# Altium schematic sheet 3_bp_filter.SchDoc
size A; SheetNumber: 4; SheetTotal: 7
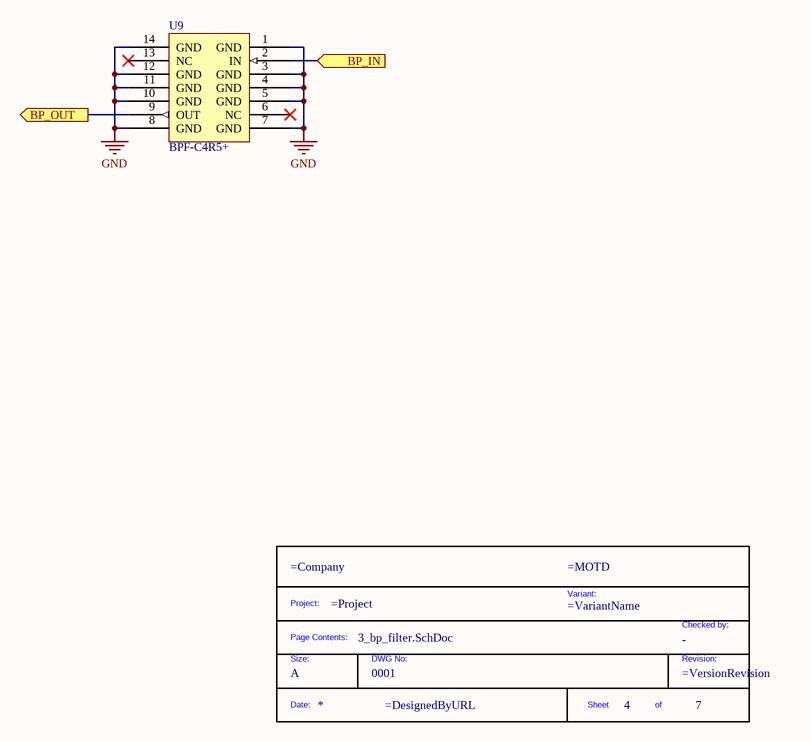
[diagram p0: 3_bp_filter.SchDoc]

## Parts
*?  DWG No: 0001  Size: A  (hidden comment: TitleBlock)  (graphical)
U9  BPF-C4R5+  [BPF-C4R5+-Footprint-1]

## Ports
BP_IN (in), BP_OUT (out)

## Nets
GND: U9.1(GND) U9.3(GND) U9.4(GND) U9.5(GND) U9.7(GND) U9.8(GND) U9.10(GND) U9.11(GND) U9.12(GND) U9.14(GND)
BP_IN: U9.2(IN) ; port BP_IN
BP_OUT: U9.9(OUT) ; port BP_OUT

Not connected (* = marked no-connect by the designer): U9 6(NC)* 13(NC)*

## Notes on the sheet
- (in symbol TitleBlock) Project:; Variant:; Checked by:; Page Contents:; Size:; DWG No:; Revision:; Date:; Sheet; of

## Library data of the parts
*? = TitleBlock: Standard Title Block; Checked by: -
U9 = CMP-00025-00003-2: Rf Filter Band Pass 4.5MHZ 14SMD; Supplier 1: Mouser